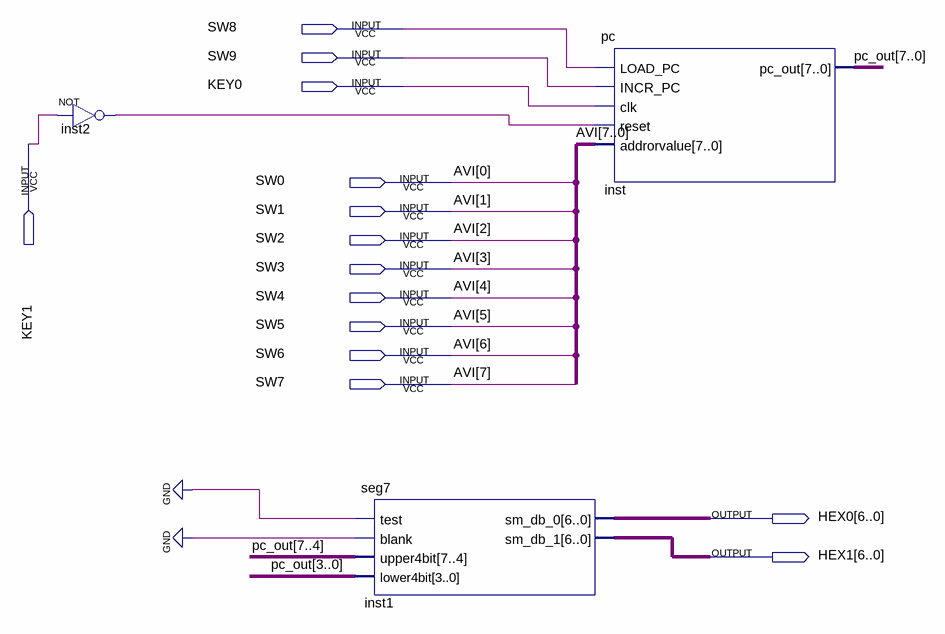
[diagram p0: schematic sheet]
// Quartus schematic pc_tb.bdf as structural Verilog: 3 symbols, 14 pins
module pc_tb (
  input  SW8,
  input  SW9,
  input  KEY0,
  input  KEY1,
  input  SW0,
  input  SW1,
  input  SW2,
  input  SW3,
  input  SW4,
  input  SW5,
  input  SW6,
  input  SW7,
  output [6:0] HEX0,
  output [6:0] HEX1
);

  wire inst2_out;
  wire [7:0] pc_out;

  not inst2 (inst2_out, KEY1);
  seg7 inst1 (
    .test(1'b0), .blank(1'b0), .upper4bit(pc_out[7:4]), .lower4bit(pc_out[3:0]), .sm_db_0(HEX0),
    .sm_db_1(HEX1));
  pc inst (
    .LOAD_PC(SW8), .INCR_PC(SW9), .clk(KEY0), .reset(inst2_out),
    .addrorvalue({SW7, SW6, SW5, SW4, SW3, SW2, SW1, SW0}), .pc_out(pc_out));

  // Other names for the same wires on the sheet: AVI[7:0] = {SW7, SW6, SW5, SW4, SW3, SW2, SW1, SW0}
endmodule
